# EAGLE design compiegne v2 (EAGLE 9.6.2)
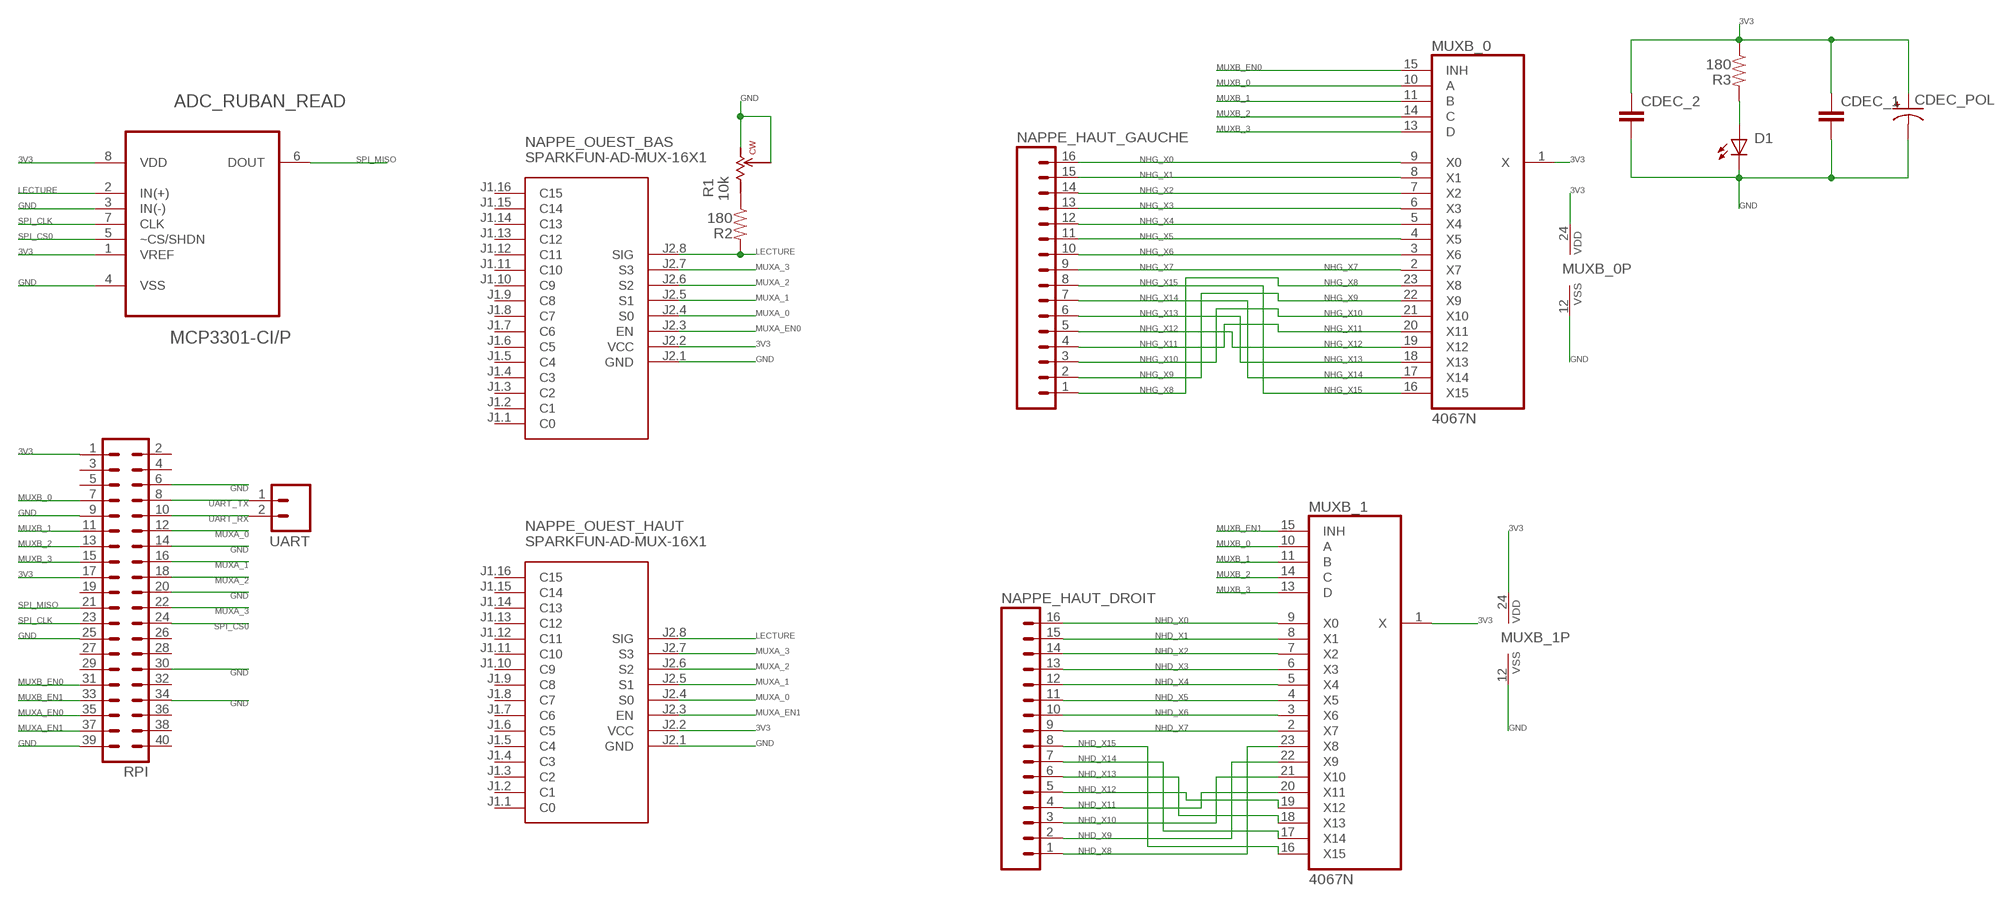
[diagram p0: schematic, sheet 1]

## Parts
ADC_RUBAN_READ  MCP3301-CI/P  [DIP254P762X432-8]
CDEC_1  PASSIF-CAP-PTH  [CAP-PTH]
CDEC_2  PASSIF-CAP-PTH  [CAP-PTH]
CDEC_POL  PASSIF-CAP_POL-TANTALUM-PTH  [CAP_POL-TANTALUM-PTH]
D1  LED-3MM  [3MM-LED]
MUXB_0  4067N  [DIL24-6]
MUXB_1  4067N  [DIL24-6]
NAPPE_HAUT_DROIT  MA16  [16PA]
NAPPE_HAUT_GAUCHE  MA16  [16PA]
NAPPE_OUEST_BAS  SPARKFUN-AD-MUX-16X1  [SPARKFUN-AD-MUX-16X1]
NAPPE_OUEST_HAUT  SPARKFUN-AD-MUX-16X1  [SPARKFUN-AD-MUX-16X1]
R1  10k  TRIMPOT_3266  [TRIMPOT_3266]
R2  180  PASSIF-RESISTOR-PTH  [RESISTOR-PTH]
R3  180  PASSIF-RESISTOR-PTH  [RESISTOR-PTH]
RPI  MA20-2  [MA20-2]
UART  MA02  [02PA]

## Nets
3V3: ADC_RUBAN_READ.1(VREF) ADC_RUBAN_READ.8(VDD) CDEC_1.P$1 CDEC_2.P$1 CDEC_POL.+ MUXB_0.1(X) MUXB_0.24(VDD) MUXB_1.1(X) MUXB_1.24(VDD) NAPPE_OUEST_BAS.J2.2(VCC) NAPPE_OUEST_HAUT.J2.2(VCC) R3.P$1 RPI.1 RPI.17
GND: ADC_RUBAN_READ.3(IN(-)) ADC_RUBAN_READ.4(VSS) CDEC_1.P$2 CDEC_2.P$2 CDEC_POL.- D1.C MUXB_0.12(VSS) MUXB_1.12(VSS) NAPPE_OUEST_BAS.J2.1(GND) NAPPE_OUEST_HAUT.J2.1(GND) R1.2 R1.3 RPI.6 RPI.9 RPI.14 RPI.20 RPI.25 RPI.30 RPI.34 RPI.39
LECTURE: ADC_RUBAN_READ.2(IN(+)) NAPPE_OUEST_BAS.J2.8(SIG) NAPPE_OUEST_HAUT.J2.8(SIG) R2.P$2
MUXA_0: NAPPE_OUEST_BAS.J2.4(S0) NAPPE_OUEST_HAUT.J2.4(S0) RPI.12
MUXA_1: NAPPE_OUEST_BAS.J2.5(S1) NAPPE_OUEST_HAUT.J2.5(S1) RPI.16
MUXA_2: NAPPE_OUEST_BAS.J2.6(S2) NAPPE_OUEST_HAUT.J2.6(S2) RPI.18
MUXA_3: NAPPE_OUEST_BAS.J2.7(S3) NAPPE_OUEST_HAUT.J2.7(S3) RPI.22
MUXA_EN0: NAPPE_OUEST_BAS.J2.3(EN) RPI.35
MUXA_EN1: NAPPE_OUEST_HAUT.J2.3(EN) RPI.37
MUXB_0: MUXB_0.10(A) MUXB_1.10(A) RPI.7
MUXB_1: MUXB_0.11(B) MUXB_1.11(B) RPI.11
MUXB_2: MUXB_0.14(C) MUXB_1.14(C) RPI.13
MUXB_3: MUXB_0.13(D) MUXB_1.13(D) RPI.15
MUXB_EN0: MUXB_0.15(INH) RPI.31
MUXB_EN1: MUXB_1.15(INH) RPI.33
N$2: R1.1 R2.P$1
N$34: D1.A R3.P$2
NHD_X0: MUXB_1.9(X0) NAPPE_HAUT_DROIT.16
NHD_X1: MUXB_1.8(X1) NAPPE_HAUT_DROIT.15
NHD_X2: MUXB_1.7(X2) NAPPE_HAUT_DROIT.14
NHD_X3: MUXB_1.6(X3) NAPPE_HAUT_DROIT.13
NHD_X4: MUXB_1.5(X4) NAPPE_HAUT_DROIT.12
NHD_X5: MUXB_1.4(X5) NAPPE_HAUT_DROIT.11
NHD_X6: MUXB_1.3(X6) NAPPE_HAUT_DROIT.10
NHD_X7: MUXB_1.2(X7) NAPPE_HAUT_DROIT.9
NHD_X8: MUXB_1.23(X8) NAPPE_HAUT_DROIT.1
NHD_X9: MUXB_1.22(X9) NAPPE_HAUT_DROIT.2
NHD_X10: MUXB_1.21(X10) NAPPE_HAUT_DROIT.3
NHD_X11: MUXB_1.20(X11) NAPPE_HAUT_DROIT.4
NHD_X12: MUXB_1.19(X12) NAPPE_HAUT_DROIT.5
NHD_X13: MUXB_1.18(X13) NAPPE_HAUT_DROIT.6
NHD_X14: MUXB_1.17(X14) NAPPE_HAUT_DROIT.7
NHD_X15: MUXB_1.16(X15) NAPPE_HAUT_DROIT.8
NHG_X0: MUXB_0.9(X0) NAPPE_HAUT_GAUCHE.16
NHG_X1: MUXB_0.8(X1) NAPPE_HAUT_GAUCHE.15
NHG_X2: MUXB_0.7(X2) NAPPE_HAUT_GAUCHE.14
NHG_X3: MUXB_0.6(X3) NAPPE_HAUT_GAUCHE.13
NHG_X4: MUXB_0.5(X4) NAPPE_HAUT_GAUCHE.12
NHG_X5: MUXB_0.4(X5) NAPPE_HAUT_GAUCHE.11
NHG_X6: MUXB_0.3(X6) NAPPE_HAUT_GAUCHE.10
NHG_X7: MUXB_0.2(X7) NAPPE_HAUT_GAUCHE.9
NHG_X8: MUXB_0.23(X8) NAPPE_HAUT_GAUCHE.1
NHG_X9: MUXB_0.22(X9) NAPPE_HAUT_GAUCHE.2
NHG_X10: MUXB_0.21(X10) NAPPE_HAUT_GAUCHE.3
NHG_X11: MUXB_0.20(X11) NAPPE_HAUT_GAUCHE.4
NHG_X12: MUXB_0.19(X12) NAPPE_HAUT_GAUCHE.5
NHG_X13: MUXB_0.18(X13) NAPPE_HAUT_GAUCHE.6
NHG_X14: MUXB_0.17(X14) NAPPE_HAUT_GAUCHE.7
NHG_X15: MUXB_0.16(X15) NAPPE_HAUT_GAUCHE.8
SPI_CLK: ADC_RUBAN_READ.7(CLK) RPI.23
SPI_CS0: ADC_RUBAN_READ.5(~CS/SHDN) RPI.24
SPI_MISO: ADC_RUBAN_READ.6(DOUT) RPI.21
UART_RX: RPI.10 UART.2
UART_TX: RPI.8 UART.1
Unconnected: NAPPE_OUEST_BAS.J1.1(C0) NAPPE_OUEST_BAS.J1.2(C1) NAPPE_OUEST_BAS.J1.3(C2) NAPPE_OUEST_BAS.J1.4(C3) NAPPE_OUEST_BAS.J1.5(C4) NAPPE_OUEST_BAS.J1.6(C5) NAPPE_OUEST_BAS.J1.7(C6) NAPPE_OUEST_BAS.J1.8(C7) NAPPE_OUEST_BAS.J1.9(C8) NAPPE_OUEST_BAS.J1.10(C9) NAPPE_OUEST_BAS.J1.11(C10) NAPPE_OUEST_BAS.J1.12(C11) NAPPE_OUEST_BAS.J1.13(C12) NAPPE_OUEST_BAS.J1.14(C13) NAPPE_OUEST_BAS.J1.15(C14) NAPPE_OUEST_BAS.J1.16(C15) NAPPE_OUEST_HAUT.J1.1(C0) NAPPE_OUEST_HAUT.J1.2(C1) NAPPE_OUEST_HAUT.J1.3(C2) NAPPE_OUEST_HAUT.J1.4(C3) NAPPE_OUEST_HAUT.J1.5(C4) NAPPE_OUEST_HAUT.J1.6(C5) NAPPE_OUEST_HAUT.J1.7(C6) NAPPE_OUEST_HAUT.J1.8(C7) NAPPE_OUEST_HAUT.J1.9(C8) NAPPE_OUEST_HAUT.J1.10(C9) NAPPE_OUEST_HAUT.J1.11(C10) NAPPE_OUEST_HAUT.J1.12(C11) NAPPE_OUEST_HAUT.J1.13(C12) NAPPE_OUEST_HAUT.J1.14(C13) NAPPE_OUEST_HAUT.J1.15(C14) NAPPE_OUEST_HAUT.J1.16(C15) RPI.2 RPI.3 RPI.4 RPI.5 RPI.19 RPI.26 RPI.27 RPI.28 RPI.29 RPI.32 RPI.36 RPI.38 RPI.40

## Library data of the parts
ADC_RUBAN_READ = Microchip_By_element14_Batch_1:MCP3301-CI/P: A/D Converter; MPN: MCP3301-CI/P; OC_FARNELL: 1332099; OC_NEWARK: 96K3722; PACKAGE: DIP-8; SUPPLIER: Microchip
CDEC_1 CDEC_2 = stock-perso:PASSIF-CAP
CDEC_POL = stock-perso:PASSIF-CAP_POL
D1 = stock-perso:LED
MUXB_0 MUXB_1 = 40xx:4067: 16-channel ANALOG MULTIPLEXER
NAPPE_HAUT_DROIT NAPPE_HAUT_GAUCHE = con-amp-quick:MA16: AMP QUICK CONNECTOR; OC_FARNELL: unknown; OC_NEWARK: unknown
NAPPE_OUEST_BAS NAPPE_OUEST_HAUT = DIY-modules:SPARKFUN-AD-MUX-16X1: SparkFun Analog/Digital MUX Breakout based on CD74HC4067 chip Source: https://www.sparkfun.com/products/9056
R1 = stock-perso:TRIMPOT_3266: TRIM POT, 1/4" BOURNS 3266
R2 R3 = stock-perso:PASSIF-RESISTOR
RPI = con-lstb:MA20-2: PIN HEADER; OC_FARNELL: unknown; OC_NEWARK: unknown
UART = con-amp-quick:MA02: AMP QUICK CONNECTOR; OC_FARNELL: unknown; OC_NEWARK: unknown

## Board
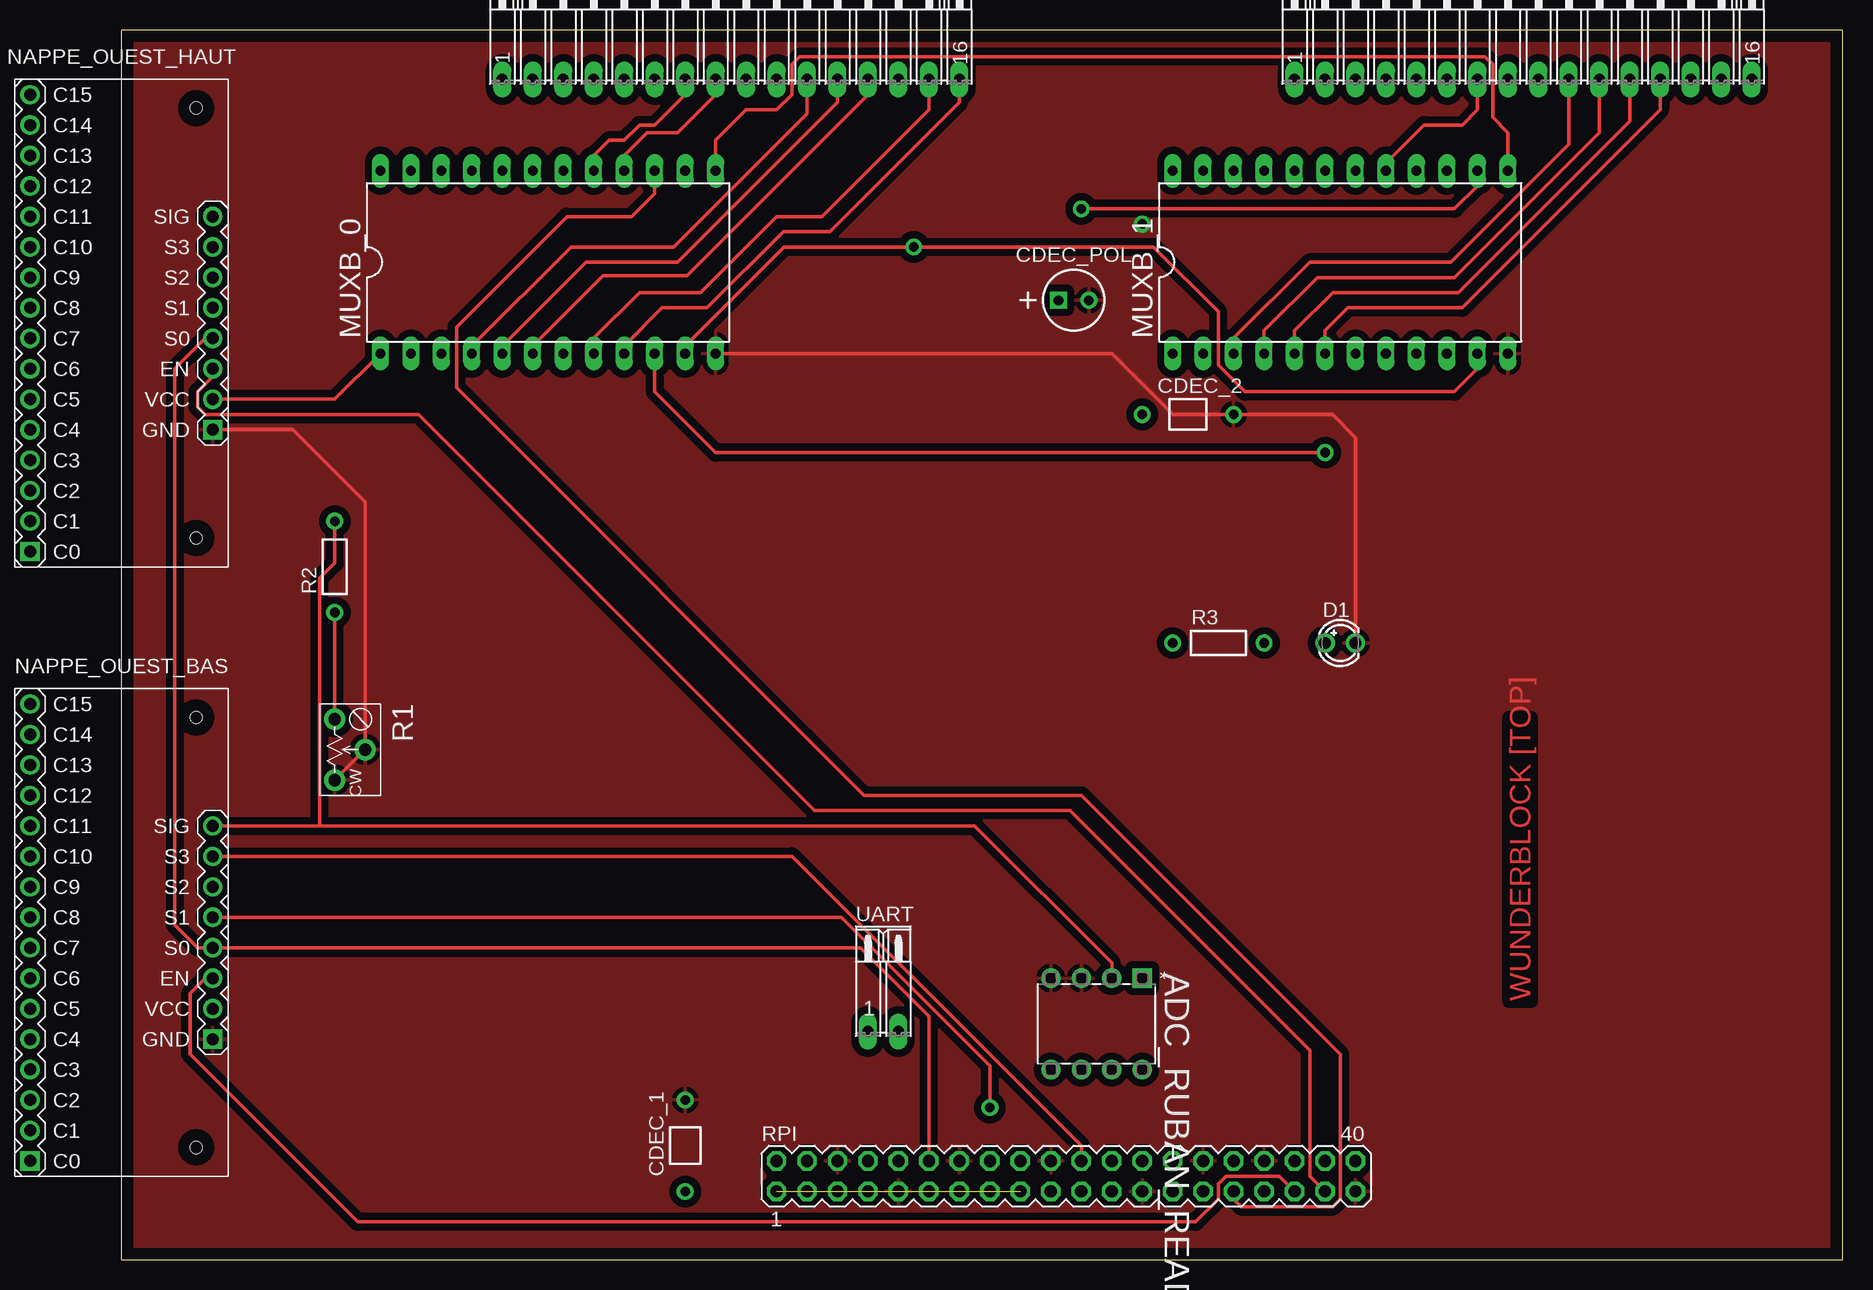
[diagram p1: board, top side]
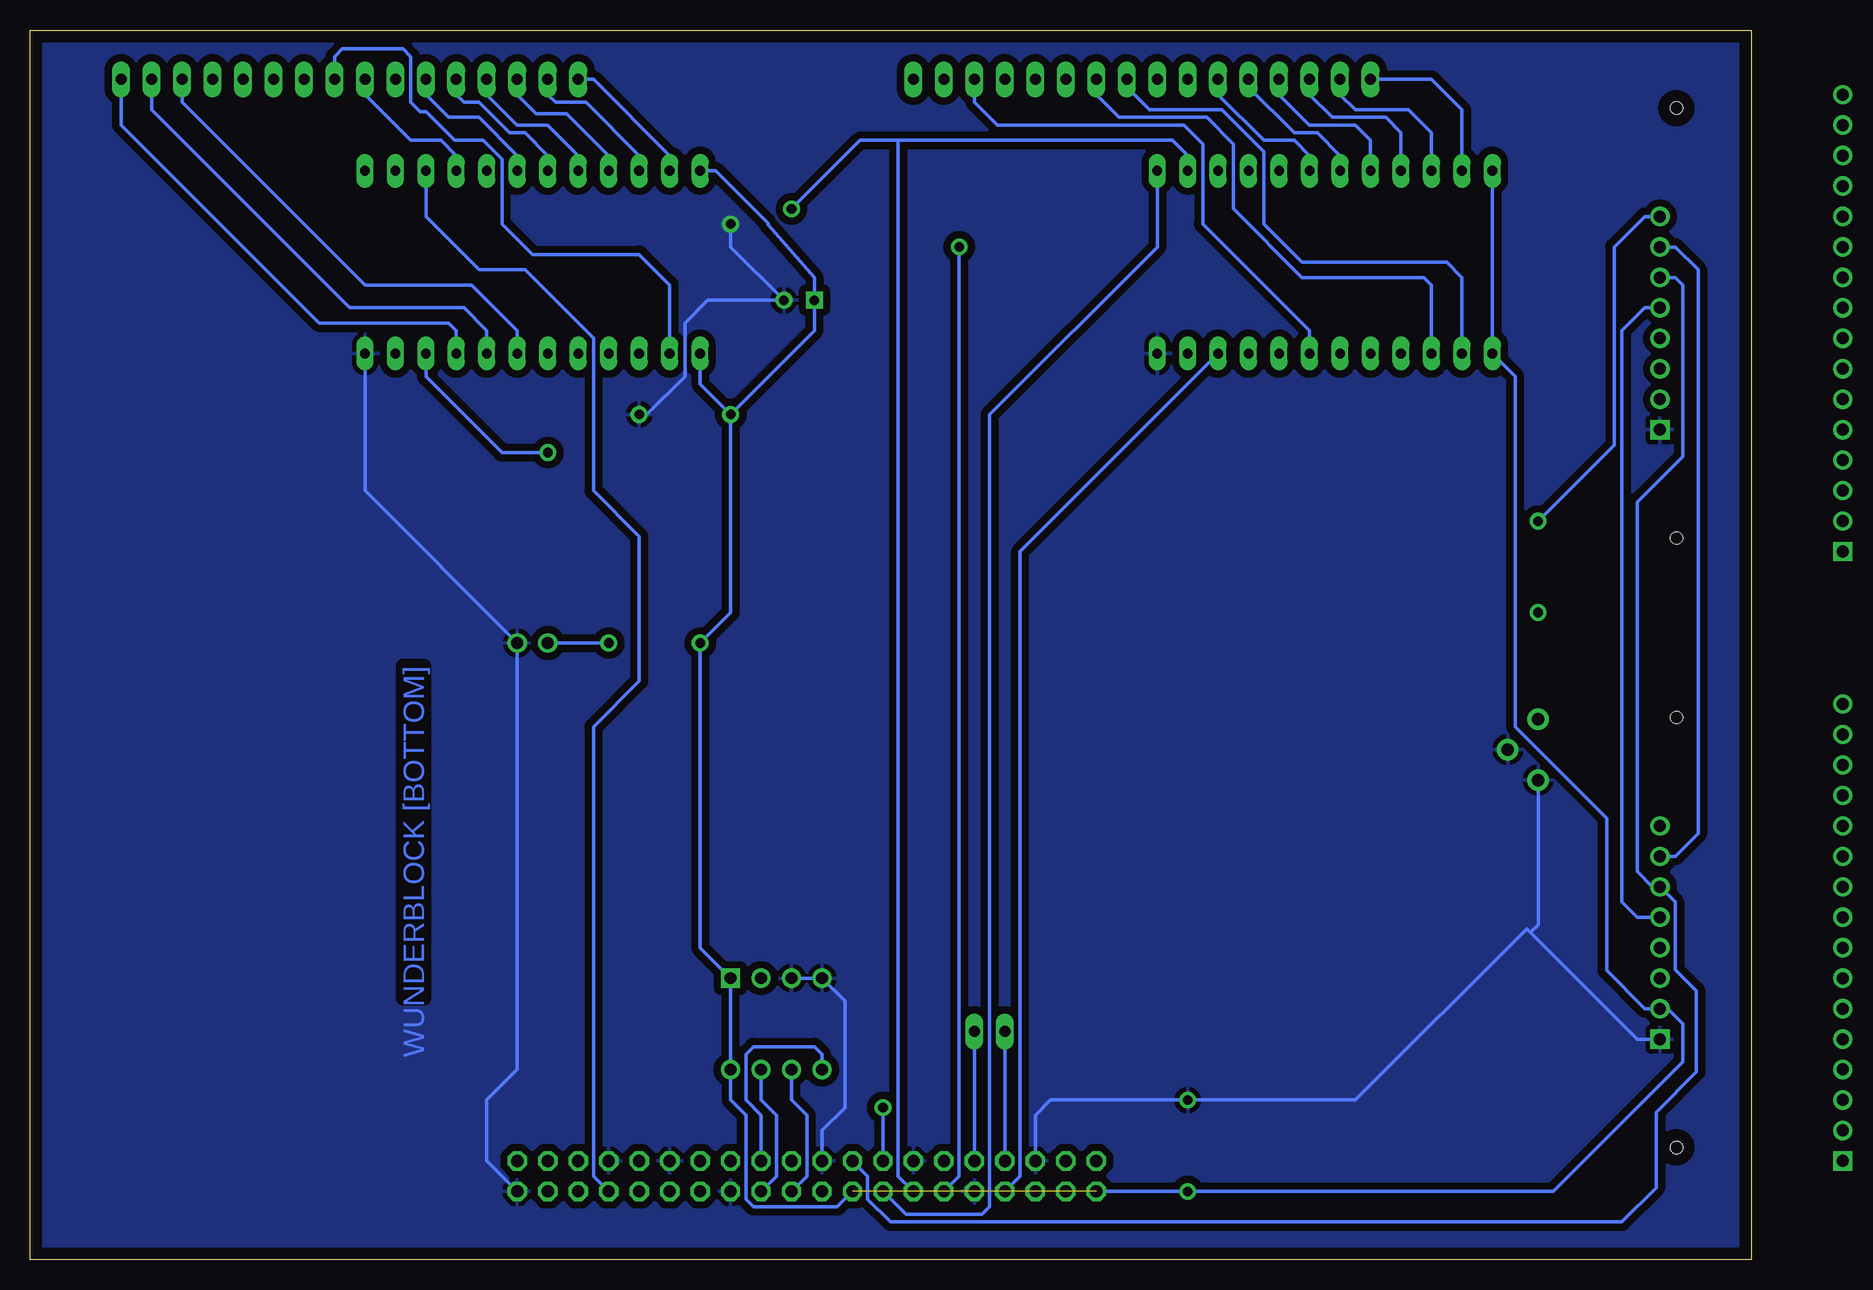
[diagram p2: board, bottom side, seen from below]

Size 143.49 x 102.54 mm. Coordinates in mm from the lower left corner, seen from the top.
Outline: 0,0 143.49,0 143.49,102.54 0,102.54 0,0
Copper layers (1*16): Top 0.035mm / dielectric 1.5mm / Bottom 0.035mm
Design rules "ENSEA_2021_gravure_humide": minimum track width 0.3mm, minimum drill 0.8mm, track to track 0.2mm, track to pad 0.2mm, pad to pad 0.185mm, via to via 0.25mm, smd to smd 0.185mm, copper to edge 1mm, drill to drill 0.4mm, minimum pad ring 0.3mm, minimum via ring 0.3mm, stop-mask expansion 4mil, vias tented up to drill 0mil, thermal gap 0.4mm

### Footprints (pad centres in the part's own frame; a part is rotated, then mirrored left to right if it is on the bottom)
DIP254P762X432-8 = drill 0.991 square: 1 -7.62,7.62 | drill 0.991: 2 -7.62,5.08; 3 -7.62,2.54; 4 -7.62,0; 5 0,0; 6 0,2.54; 7 0,5.08; 8 0,7.62
CAP-PTH = drill 0.8: P$1 -3.81,0; P$2 3.81,0
CAP_POL-TANTALUM-PTH = drill 0.8 square: + -1.27,0 | drill 0.8: - 1.27,0
3MM-LED = drill 1: A -1.27,0; C 1.27,0
DIL24-6 = drill 0.813 long: 1 -13.97,-7.62; 2 -11.43,-7.62; 3 -8.89,-7.62; 4 -6.35,-7.62; 5 -3.81,-7.62; 6 -1.27,-7.62; 7 1.27,-7.62; 8 3.81,-7.62; 9 6.35,-7.62; 10 8.89,-7.62; 11 11.43,-7.62; 12 13.97,-7.62; 13 13.97,7.62; 14 11.43,7.62; 15 8.89,7.62; 16 6.35,7.62; 17 3.81,7.62; 18 1.27,7.62; 19 -1.27,7.62; 20 -3.81,7.62; 21 -6.35,7.62; 22 -8.89,7.62; 23 -11.43,7.62; 24 -13.97,7.62
16PA = drill 0.914 long: 1 -19.05,0; 2 -16.51,0; 3 -13.97,0; 4 -11.43,0; 5 -8.89,0; 6 -6.35,0; 7 -3.81,0; 8 -1.27,0; 9 1.27,0; 10 3.81,0; 11 6.35,0; 12 8.89,0; 13 11.43,0; 14 13.97,0; 15 16.51,0; 16 19.05,0
SPARKFUN-AD-MUX-16X1 = drill 1 square: J1.1 -7.62,-19.05; J2.1 7.62,-8.89 | drill 1: J1.2 -7.62,-16.51; J1.3 -7.62,-13.97; J1.4 -7.62,-11.43; J1.5 -7.62,-8.89; J1.6 -7.62,-6.35; J1.7 -7.62,-3.81; J1.8 -7.62,-1.27; J1.9 -7.62,1.27; J1.10 -7.62,3.81; J1.11 -7.62,6.35; J1.12 -7.62,8.89; J1.13 -7.62,11.43; J1.14 -7.62,13.97; J1.15 -7.62,16.51; J1.16 -7.62,19.05; J2.2 7.62,-6.35; J2.3 7.62,-3.81; J2.4 7.62,-1.27; J2.5 7.62,1.27; J2.6 7.62,3.81; J2.7 7.62,6.35; J2.8 7.62,8.89 | hole 1: 6.245,-17.93; 6.245,17.93
TRIMPOT_3266 = drill 1.016 pad 1.778: 1 -2.54,-1.27; 2 0,1.27; 3 2.54,-1.27
RESISTOR-PTH = drill 0.8: P$1 -3.81,0; P$2 3.81,0
MA20-2 = drill 1.016 octagon: 1 -24.13,-1.27; 2 -24.13,1.27; 3 -21.59,-1.27; 4 -21.59,1.27; 5 -19.05,-1.27; 6 -19.05,1.27; 7 -16.51,-1.27; 8 -16.51,1.27; 9 -13.97,-1.27; 10 -13.97,1.27; 11 -11.43,-1.27; 12 -11.43,1.27; 13 -8.89,-1.27; 14 -8.89,1.27; 15 -6.35,-1.27; 16 -6.35,1.27; 17 -3.81,-1.27; 18 -3.81,1.27; 19 -1.27,-1.27; 20 -1.27,1.27; 21 1.27,-1.27; 22 1.27,1.27; 23 3.81,-1.27; 24 3.81,1.27; 25 6.35,-1.27; 26 6.35,1.27; 27 8.89,-1.27; 28 8.89,1.27; 29 11.43,-1.27; 30 11.43,1.27; 31 13.97,-1.27; 32 13.97,1.27; 33 16.51,-1.27; 34 16.51,1.27; 35 19.05,-1.27; 36 19.05,1.27; 37 21.59,-1.27; 38 21.59,1.27; 39 24.13,-1.27; 40 24.13,1.27
02PA = drill 0.914 long: 1 -1.27,0; 2 1.27,0

### Placement (x,y rotation side)
ADC_RUBAN_READ  77.47,15.88 270 top
CDEC_1  46.99,9.53 90 top
CDEC_2  88.9,70.48 0 top
CDEC_POL  79.38,80.01 0 top
D1  101.6,51.44 0 top
MUXB_0  35.56,83.19 0 top
MUXB_1  101.6,83.19 0 top
NAPPE_HAUT_DROIT  116.84,98.42 0 top
NAPPE_HAUT_GAUCHE  50.8,98.42 0 top
NAPPE_OUEST_BAS  0,27.3 0 top
NAPPE_OUEST_HAUT  0,78.11 0 top
R1  19.05,42.55 270 top
R2  17.78,57.79 90 top
R3  91.44,51.44 0 top
RPI  78.74,6.99 0 top
UART  63.5,19.05 0 top

### Tracks (layer width: path | path; a pad name or v marks a point on that pad's centre or on a via)
3V3  (1 unrouted)
  Top 0.3: NAPPE_OUEST_HAUT.J2.2 17.78,71.75 MUXB_0.1
  Bottom 0.3: RPI.17 76.2,4.45 83.19,4.45 83.82,5.08 83.82,12.06 85.09,13.33 ADC_RUBAN_READ.8 ADC_RUBAN_READ.1 87.63,26.04 R3.P$1 85.09,53.98 CDEC_2.P$1 | CDEC_2.P$1 87.63,73.03 MUXB_1.1 | CDEC_2.P$1 78.11,77.47 CDEC_POL.+ 78.11,81.92 81.98,86.3 81.98,86.42 86.36,90.81 MUXB_1.24 | MUXB_0.24 MUXB_0.1 19.68,73.66 19.68,44.45 12.06,36.83 12.06,24.13 8.89,20.96 NAPPE_OUEST_BAS.J2.2 6.99,20.96 5.71,19.69 5.71,16.51 16.51,5.71 CDEC_1.P$1 RPI.1
GND  (via drill 0.8)
  Top 0.3: MUXB_0.12 82.55,75.56 87.63,70.48 CDEC_2.P$2 100.97,70.48 102.87,68.58 D1.C | NAPPE_OUEST_HAUT.J2.1 14.29,69.22 20.32,63.18 R1.2 R1.3 | RPI.14 69.85,7.62
  Bottom 0.3: 18.41,27.3 18.73,27.62 33.02,13.33 CDEC_1.P$2 58.42,13.33 59.69,12.06 RPI.6 | 18.41,27.3 9.53,18.42 NAPPE_OUEST_BAS.J2.1 | 18.41,27.3 17.78,27.94 R1.3 | CDEC_2.P$2 92.08,70.48 88.9,73.66 88.9,78.11 87,80.01 CDEC_POL.- 85.09,84.45 v85.09,86.36 | MUXB_1.12 115.57,64.13 D1.C 102.87,15.88 105.41,13.33 105.41,8.25 RPI.39 | ADC_RUBAN_READ.3 ADC_RUBAN_READ.4 75.56,21.59 75.56,12.7 77.47,10.79 RPI.20
  pour Bottom (isolate 0.61): 0,102.23 143.51,102.23 143.51,0 0,0
  pour Top (isolate 0.61): 0,102.23 143.51,102.23 143.51,0 0,0
LECTURE
  Top 0.3: ADC_RUBAN_READ.2 82.55,24.77 71.12,36.2 16.51,36.2 | NAPPE_OUEST_BAS.J2.8 16.51,36.2 | R2.P$2 17.78,58.1 16.51,56.83 16.51,36.2
  Bottom 0.3: R2.P$2 11.43,67.95 11.43,84.45 8.89,87 NAPPE_OUEST_HAUT.J2.8
MUXA_0
  Top 0.3: NAPPE_OUEST_HAUT.J2.4 6.99,76.84 4.45,74.3 4.45,27.94 6.35,26.04 NAPPE_OUEST_BAS.J2.4 61.59,26.04 67.31,20.32 RPI.12
MUXA_1  (via drill 0.8)
  Top 0.3: v72.39,12.7 72.39,16.19 60.01,28.58 NAPPE_OUEST_BAS.J2.5
  Bottom 0.3: NAPPE_OUEST_BAS.J2.5 9.53,28.58 10.79,29.85 10.79,77.47 8.89,79.38 NAPPE_OUEST_HAUT.J2.5 | v72.39,12.7 RPI.16
MUXA_2
  Bottom 0.3: NAPPE_OUEST_HAUT.J2.6 6.35,81.92 5.71,81.28 5.71,66.99 9.53,63.18 9.53,32.38 8.26,31.12 NAPPE_OUEST_BAS.J2.6 6.35,29.85 6.35,24.2 4.58,22.43 4.58,15.67 7.94,12.31 7.94,6.03 10.79,3.17 71.75,3.17 73.66,5.08 73.66,6.99 RPI.18
MUXA_3
  Top 0.3: RPI.22 80.01,9.53 55.88,33.66 NAPPE_OUEST_BAS.J2.7
  Bottom 0.3: NAPPE_OUEST_BAS.J2.7 6.35,33.66 4.45,35.56 4.45,82.55 6.35,84.45 NAPPE_OUEST_HAUT.J2.7
MUXA_EN0
  Top 0.3: NAPPE_OUEST_BAS.J2.3 6.99,23.5 5.71,22.23 5.71,17.14 19.68,3.17 89.53,3.17 91.44,5.08 91.44,6.35 92.08,6.99 96.52,6.99 RPI.35
MUXA_EN1
  Top 0.3: NAPPE_OUEST_HAUT.J2.3 7.62,73.66 6.35,72.39 6.35,71.12 6.99,70.48 24.77,70.48 57.78,37.47 79.06,37.47 99.06,17.46 99.06,6.99 RPI.37
MUXB_0  (via drill 0.8)
  Top 0.3: v100.33,67.31 49.53,67.31 44.45,72.39 MUXB_0.10
  Bottom 0.3: MUXB_0.10 60.96,59.05 60.96,6.99 RPI.7 | MUXB_1.10 110.49,73.66 104.14,67.31 v100.33,67.31
MUXB_1  (via drill 0.8)
  Top 0.3: MUXB_0.11 46.99,76.2 55.24,84.45 v66.04,84.45 86.04,84.45 91.44,79.06 91.44,74.61 93.66,72.39 111.12,72.39 113.03,74.3 MUXB_1.11
  Bottom 0.3: RPI.11 66.04,6.99 v66.04,84.45
MUXB_2  (via drill 0.8)
  Top 0.3: MUXB_1.14 113.03,89.53 111.12,87.63 v80.01,87.63
  Bottom 0.3: MUXB_0.14 46.99,92.08 48.26,93.34 71.12,93.34 | RPI.13 71.12,6.99 71.12,93.34 | v80.01,87.63 74.3,93.34 71.12,93.34
MUXB_3
  Top 0.3: MUXB_1.13 115.57,93.98 114.3,95.25 114.3,99.7 113.67,100.33 56.52,100.33 55.88,99.7 55.88,97.16 54.61,95.89 52.07,95.89 49.53,93.34 MUXB_0.13
  Bottom 0.3: RPI.15 70.48,3.81 64.14,3.81 63.5,4.45 63.5,70.48 49.53,84.45 MUXB_0.13
MUXB_EN0
  Top 0.3: MUXB_0.15 44.45,88.9 42.55,87 37.15,87 27.94,77.79 27.94,72.71 61.91,38.73 80.01,38.73 101.6,17.14 101.6,5.08 100.97,4.45 93.34,4.45 92.71,5.08 RPI.31
MUXB_EN1
  Bottom 0.3: RPI.33 96.52,6.99 96.52,44.45 92.71,48.26 92.71,60.33 96.52,64.13 96.52,76.84 102.23,82.55 106.05,82.55 110.49,87 MUXB_1.15
N$2
  Top 0.3: R1.1 R2.P$1
N$34
  Bottom 0.3: D1.A R3.P$2
NHD_X0
  Bottom 0.3: NAPPE_HAUT_DROIT.16 135.89,94.61 119.38,78.11 108.58,78.11 107.95,77.47 MUXB_1.9
NHD_X1
  Bottom 0.3: NAPPE_HAUT_DROIT.15 133.35,95.89 116.84,79.38 107.31,79.38 105.41,77.47 MUXB_1.8
NHD_X2
  Bottom 0.3: NAPPE_HAUT_DROIT.14 130.81,96.52 115.57,81.28 106.68,81.28 102.87,77.47 MUXB_1.7
NHD_X3
  Top 0.3: MUXB_1.6 100.33,77.47 102.23,79.38 111.76,79.38 128.27,95.89 NAPPE_HAUT_DROIT.13
NHD_X4
  Top 0.3: MUXB_1.5 97.79,77.47 100.97,80.64 111.44,80.64 125.73,94.93 NAPPE_HAUT_DROIT.12
NHD_X5
  Top 0.3: MUXB_1.4 95.25,77.47 99.69,81.92 111.12,81.92 123.19,93.98 NAPPE_HAUT_DROIT.11
NHD_X6
  Top 0.3: MUXB_1.3 92.71,76.84 99.06,83.19 110.81,83.19 120.65,93.03 NAPPE_HAUT_DROIT.10
NHD_X7
  Bottom 0.3: NAPPE_HAUT_DROIT.9 118.11,100.33 117.47,100.97 112.39,100.97 111.76,100.33 111.76,96.52 110.97,95.73 110.49,95.73 108.11,93.34 105.73,93.34 104.14,91.76 104.14,86.36 101.6,83.82 92.71,83.82 90.17,81.28 MUXB_1.2
NHD_X8
  Bottom 0.3: MUXB_1.23 90.17,92.08 96.52,98.42 NAPPE_HAUT_DROIT.1
NHD_X9
  Bottom 0.3: NAPPE_HAUT_DROIT.2 100.33,97.16 99.69,96.52 97.16,96.52 92.71,92.08 MUXB_1.22
NHD_X10
  Bottom 0.3: NAPPE_HAUT_DROIT.3 102.87,97.16 101.28,95.57 98.74,95.57 95.25,92.08 MUXB_1.21
NHD_X11
  Bottom 0.3: NAPPE_HAUT_DROIT.4 105.41,97.16 102.87,94.61 100.33,94.61 97.79,92.08 MUXB_1.20
NHD_X12
  Bottom 0.3: NAPPE_HAUT_DROIT.5 107.95,97.16 107.31,96.52 106.05,96.52 103.5,93.98 102.23,93.98 100.33,92.08 MUXB_1.19
NHD_X13
  Bottom 0.3: MUXB_1.18 102.87,92.08 106.05,95.25 108.58,95.25 110.49,97.16 NAPPE_HAUT_DROIT.6
NHD_X14
  Top 0.3: NAPPE_HAUT_DROIT.7 113.03,95.89 111.76,94.61 108.58,94.61 105.41,91.44 MUXB_1.17
NHD_X15
  Bottom 0.3: NAPPE_HAUT_DROIT.8 115.57,97.16 111.76,93.34 109.22,93.34 107.95,92.08 MUXB_1.16
NHG_X0
  Top 0.3: MUXB_0.9 41.91,76.2 45.09,79.38 48.82,79.38 55.17,85.72 59.05,85.72 69.85,96.52 NAPPE_HAUT_GAUCHE.16
NHG_X1
  Top 0.3: MUXB_0.8 39.37,76.84 43.18,80.64 48.26,80.64 54.61,87 58.42,87 67.31,95.89 NAPPE_HAUT_GAUCHE.15
NHG_X2
  Bottom 0.3: MUXB_0.7 36.83,77.47 45.72,86.36 45.72,93.03 47.31,94.61 62.87,94.61 64.77,96.52 NAPPE_HAUT_GAUCHE.14
NHG_X3
  Top 0.3: MUXB_0.6 34.29,76.2 40.16,82.07 47.15,82.07 62.23,97.16 NAPPE_HAUT_GAUCHE.13
NHG_X4
  Top 0.3: MUXB_0.5 31.75,76.2 38.73,83.19 46.35,83.19 59.69,96.52 NAPPE_HAUT_GAUCHE.12
NHG_X5
  Top 0.3: MUXB_0.4 29.21,76.2 37.47,84.45 46.04,84.45 57.15,95.57 NAPPE_HAUT_GAUCHE.11
NHG_X6
  Bottom 0.3: NAPPE_HAUT_GAUCHE.10 54.61,97.16 52.7,95.25 45.4,95.25 43.18,93.03 43.18,87.63 37.47,81.92 27.3,81.92 26.67,81.28 MUXB_0.3
NHG_X7
  Bottom 0.3: NAPPE_HAUT_GAUCHE.9 52.07,97.79 50.16,95.89 44.13,95.89 40.64,92.39 40.64,86.36 37.47,83.19 25.4,83.19 24.13,81.92 MUXB_0.2
NHG_X8
  Bottom 0.3: NAPPE_HAUT_GAUCHE.1 26.67,98.42 24.13,95.89 MUXB_0.23
NHG_X9
  Bottom 0.3: NAPPE_HAUT_GAUCHE.2 34.29,97.16 33.02,95.89 28.57,95.89 26.67,93.98 MUXB_0.22
NHG_X10
  Bottom 0.3: NAPPE_HAUT_GAUCHE.3 36.83,97.16 34.92,95.25 30.48,95.25 29.21,93.98 MUXB_0.21
NHG_X11
  Bottom 0.3: MUXB_0.20 31.75,93.34 33.02,94.61 36.83,94.61 39.37,97.16 NAPPE_HAUT_GAUCHE.4
NHG_X12
  Bottom 0.3: NAPPE_HAUT_GAUCHE.5 41.91,97.79 38.1,93.98 36.2,93.98 34.29,92.08 MUXB_0.19
NHG_X13
  Bottom 0.3: MUXB_0.18 36.83,92.08 38.1,93.34 40.64,93.34 44.45,97.16 NAPPE_HAUT_GAUCHE.6
NHG_X14
  Top 0.3: NAPPE_HAUT_GAUCHE.7 46.99,97.16 44.45,94.61 43.18,94.61 41.91,93.34 40.64,93.34 39.37,92.08 MUXB_0.17
NHG_X15
  Top 0.3: NAPPE_HAUT_GAUCHE.8 49.53,97.16 46.35,93.98 43.81,93.98 41.91,92.08 MUXB_0.16
SPI_CLK
  Bottom 0.3: ADC_RUBAN_READ.7 82.55,13.33 81.28,12.06 81.28,6.99 RPI.23
SPI_CS0
  Bottom 0.3: RPI.24 82.55,12.06 83.82,13.33 83.82,17.14 83.19,17.78 78.11,17.78 77.47,17.14 ADC_RUBAN_READ.5
SPI_MISO
  Bottom 0.3: ADC_RUBAN_READ.6 80.01,13.33 78.74,12.06 78.74,6.99 RPI.21
UART_RX
  Bottom 0.3: RPI.10 UART.2
UART_TX
  Bottom 0.3: RPI.8 UART.1

### Text on the board
Top: WUNDERBLOCK [TOP]
Bottom: WUNDERBLOCK [BOTTOM]